# Altium project acopians-hw.PrjPcb (part 1 of 2)
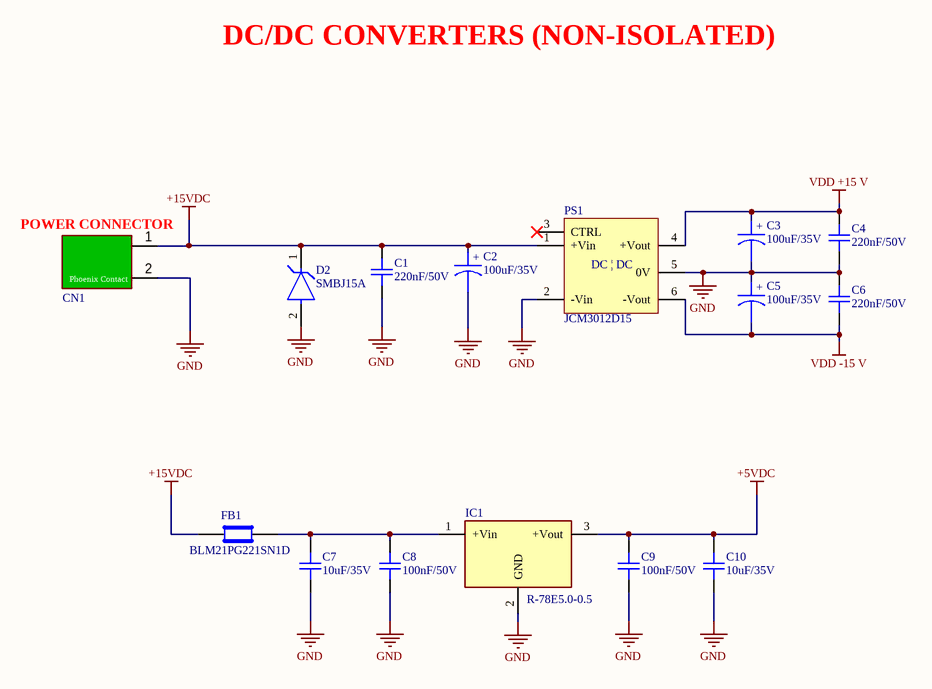
[diagram p0: power-supply-hw.SchDoc]
Project Link: =ProjectLink
5 sheets, 79 parts. Net scope: global (net labels, ports and power ports of the same name join across sheets).
Board file: pcb-power-supply-measurement-hw.PcbDoc
Sheets:
  power-supply-hw.SchDoc
  vmon-and-imon-measurements-hw.SchDoc
  outputs-voltage-and-current-measurements-hw.SchDoc
  voltage-and-current-display-hw.SchDoc
  monitoring-sources-with-mbed-hw.SchDoc

## Sheet power-supply-hw.SchDoc
size A4; DrawnBy: Rogério J. Marcondeli / Samuel C. Z. Fraga

### Parts
C1  220nF/50V  [C0805]
C2  100uF/35V  [CAP_ALUM_case_D8]
C3  100uF/35V  [CAP_ALUM_case_D8]
C4  220nF/50V  [C0805]
C5  100uF/35V  [CAP_ALUM_case_D8]
C6  220nF/50V  [C0805]
C7  10uF/35V  [C0805]
C8  100nF/50V  [C0805]
C9  100nF/50V  [C0805]
C10  10uF/35V  [C0805]
CN1  1755736  [Conector Phoenix 2 vias 1755736]  (value not drawn)
D2  SMBJ15A  [FP-SMBJ-MFG]
FB1  BLM21PG221SN1D  [Ferrite_Bead_0805]
IC1  R-78E5.0-0.5  [R-78E5.0-0.5]
PS1  JCM3012D15  [JCM30]

### Nets
+5VDC: C9.2 C10.2 IC1.3(+Vout)
+15VDC: C1.2 C2.1(Lid_+) CN1.1 D2.1(C) FB1.1 PS1.1(+Vin)
GND: C1.1 C2.2 C3.2 C4.1 C5.1(Lid_+) C6.1 C7.1 C8.1 C9.1 C10.1 CN1.2 D2.2(A) IC1.2(GND) PS1.2(-Vin) PS1.5(0V)
VDD +15 V: C3.1(Lid_+) C4.2 PS1.4(+Vout)
VDD -15 V: C5.2 C6.2 PS1.6(-Vout)
NetC7_2: C7.2 C8.2 FB1.2 IC1.1(+Vin)

Not connected (* = marked no-connect by the designer): PS1 3(CTRL)*

### Notes on the sheet
- DC/DC CONVERTERS (NON-ISOLATED)
- (near CN1) POWER CONNECTOR
- Authors:
- Title:
- Revision:
- File:
- Project:
- Date:
- Variant:
- Sheet
- of
- DAT - INE - EMI
  Eletrônica e
  Microeletrônica
- (in symbol CAPACITOR 100uF/35V) +
- (in symbol JCM3012D15) DC | DC

### Library data of the parts
C1 C4 C6 = CAPACITOR 220nF/50V: Capacitor 220NF 50V X7R 0805; Manufacturer: Murata; Manufacturer Part Number: GRM21BR71H224MA01L; Tolerance: 20%; Código LNLS: AP112018; Supplier 1: Digi-Key; RoHS: Yes; Category: Ceramic Capacitors; Stock 1: 27774; Pricing 1: 1=0,37000, 10=0,25200, 50=0,16800, 100=0,14270, 500=0,10074, 1000=0,08815 (USD); Mount: Surface Mount; Case/Package: 0805; Case Code (Metric): 2012; Case Code (Imperial): 0805; Min Operating Temperature: -55°C; Max Operating Temperature: 125°C; Package Quantity: 1; Capacitance: 220nF; Packaging: Tape and Reel; Voltage Rating: 50V; Dielectric: X7R; Termination: SMD/SMT; Voltage Rating (DC): 50V; Series: GRM; Construction: Flat; Length: 2mm; Width: 0.049inch; Height: 1.25mm; Thickness: 0.053inch; Depth: 1.25mm; Radiation Hardening: No; Lead Free: Lead Free; RoHS Compliant: Yes; ComponentLink1URL: https://datasheet.ciiva.com/5421/product-5421097.pdf?src-supplier=Mouser; ComponentLink1Description: https://datasheet.ciiva.com/5421/product-5421097.pdf?src-supplier=Mouser; ComponentLink2URL: https://datasheet.ciiva.com/136/partnumbering-e-01-136537.pdf?src-supplier=Digi-Key; ComponentLink2Description: https://datasheet.ciiva.com/136/partnumbering-e-01-136537.pdf?src-supplier=Digi-Key; ComponentLink3URL: https://datasheet.ciiva.com/136/partnumbering-e-01-136536.pdf?src-supplier=Digi-Key; ComponentLink3Description: https://datasheet.ciiva.com/136/partnumbering-e-01-136536.pdf?src-supplier=Digi-Key; ComponentLink4URL: https://datasheet.ciiva.com/136/partnumbering-e-01-136538.pdf?src-supplier=Digi-Key; ComponentLink4Description: https://datasheet.ciiva.com/136/partnumbering-e-01-136538.pdf?src-supplier=Digi-Key; Supplier Part Number 1: 490-1671-1-ND
C2 C3 C5 = CAPACITOR 100uF/35V: Capacitor Alum 100UF 35V 20% SMD - EEE-HAV101XAP; Manufacturer: Panasonic; Capacitance: 100µF; Lifetime @ Temp.: 1000 Hrs @ 105°C; Ripple Current: 84mA; Surface Mount Land Size: 0.260" L x 0.260" W (6.60mm x 6.60mm); Código LNLS: AP105066; Part Number: EEE-HAV101XAP; Supplier 1: Digi-Key; Supplier Part Number 1: PCE4726CT-ND; Value: 100uF; Manufacturer Part Number: EEE-HAV101XAP; RoHS: RoHS Compliant; Category: Capacitors; Stock 1: 1957; Pricing 1: 1=0.63, 50=0.3758, 100=0.3289, 250=0.2584, 500=0.2349 (USD); Packaging: Cut Tape (CT); Tolerance: ±20%; Voltage Rating: 35V; ESR (Equivalent Series Resistance): -; Operating Temperature: -40°C ~ 105°C; Type: -; Applications: Automotive; Impedance: -; Lead Spacing: -; Size / Dimension: 0.248" Dia (6.30mm); Height - Seated (Max): 0.303" (7.70mm); Mounting Type: Surface Mount; Package / Case: Radial, Can - SMD; ComponentLink1URL: http://industrial.panasonic.com/www-cgi/jvcr13pz.cgi?E+PZ+3+ABA0116+EEEHAV101XAP+7+WW; ComponentLink1Description: http://industrial.panasonic.com/www-cgi/jvcr13pz.cgi?E+PZ+3+ABA0116+EEEHAV101XAP+7+WW
C7 C10 = CAPACITOR 10uF/35V: Capacitor 10UF 35V X5R 0805; Manufacturer: TDK; Manufacturer Part Number: C2012X5R1V106K085AC; Dielectric Material: Ceramic; Tolerance: 10%; Código LNLS: AP105062; Supplier 1: Digi-Key; Stock 1: 56135; Pricing 1: 1=0.73, 10=0.519, 100=0.3416, 500=0.253, 1000=0.2151 (USD); Case/Package: 0805; Weight: 0.000194oz; Case Code (Metric): 2012; Case Code (Imperial): 0805; Min Operating Temperature: -55°C; Max Operating Temperature: 85°C; Package Quantity: 1; Packaging: Tape and Reel; Capacitance: 10uF; Voltage Rating: 35V; Dielectric: X5R; Termination: SMD/SMT; Voltage Rating (DC): 35V; Length: 0.079inch; Height: 0.85mm; Width: 0.049inch; Thickness: 0.039inch; REACH SVHC: No SVHC; Lead Free: Lead Free; ComponentLink1URL: https://datasheet.ciiva.com/14894/tdkmlcccaprange-14894527.pdf; ComponentLink1Description: https://datasheet.ciiva.com/14894/tdkmlcccaprange-14894527.pdf; Supplier Part Number 1: 445-14417-1-ND
C8 C9 = CAPACITOR 100nF/50V: Capacitor 0.1UF 50V X7R 0805; Manufacturer 1: Kyocera AVX; Manufacturer Part Number 1: 08055C104KAZ2A; Description 1: Capacitor Ceramic 0.1uF 50V X7R 10% SMD 0805 FlexiTerm 125C Paper T/R; Category 1: Ceramic Capacitors; Capacitance: 100nF; Tolerance: 10%; Temperature Coefficient: 30ppm/°C; Dissipation Factor: 2.5%; Código LNLS: AP106675; Supplier 1: Arrow Electronics; Supplier Part Number 1: 08055C104KAZ2A; RoHS 1: Yes; Stock 1: 28000; Pricing 1: 4000=0,0262 (USD); Mount: Surface Mount,PCB; Case/Package: 0805; Number of Pins: 2; Case Code (Metric): 2012; Case Code (Imperial): 0805; Min Operating Temperature: -55°C; Max Operating Temperature: 125°C; Packaging: Tape and Reel; Voltage Rating (DC): 50V; Dielectric: X7R; Package Quantity: 4000; Series: FLEXITERM®; Voltage Rating: 50V; Termination: SMD/SMT; Voltage: 50V; Features: Soft Termination; Construction: Flat; Length: 2.01mm; Width: 1.25mm; Height: 0.94mm; Depth: 1.25mm; Reach SVHC Compliant: No; Lead Free: Lead Free; RoHS Compliant: Yes; ComponentLink1URL: https://datasheet.ciiva.com/28613/630895-28613376.pdf?src-supplier=Element14; ComponentLink1Description: https://datasheet.ciiva.com/28613/630895-28613376.pdf?src-supplier=Element14; ComponentLink2URL: https://datasheet.ciiva.com/11788/0900766b80dc2409-11788550.pdf?src-supplier=Rs; ComponentLink2Description: https://datasheet.ciiva.com/11788/0900766b80dc2409-11788550.pdf?src-supplier=Rs; ComponentLink3URL: https://datasheet.ciiva.com/30514/2014094-30514066.pdf?src-supplier=Jameco; ComponentLink3Description: https://datasheet.ciiva.com/30514/2014094-30514066.pdf?src-supplier=Jameco; ComponentLink4URL: https://datasheet.ciiva.com/11499/flexiterm-11499901.pdf?src-supplier=Avnet; ComponentLink4Description: https://datasheet.ciiva.com/11499/flexiterm-11499901.pdf?src-supplier=Avnet; ComponentLink5URL: https://datasheet.ciiva.com/5417/cx7r-218113-5417323.pdf?src-supplier=Mouser; ComponentLink5Description: https://datasheet.ciiva.com/5417/cx7r-218113-5417323.pdf?src-supplier=Mouser; ComponentLink6URL: https://datasheet.ciiva.com/28613/630895-28613368.pdf?src-supplier=Element14; ComponentLink6Description: https://datasheet.ciiva.com/28613/630895-28613368.pdf?src-supplier=Element14; ComponentLink7URL: https://datasheet.ciiva.com/151/flexiterm-151512.pdf?src-supplier=Digi-Key; ComponentLink7Description: https://datasheet.ciiva.com/151/flexiterm-151512.pdf?src-supplier=Digi-Key; ComponentLink8URL: https://datasheet.ciiva.com/151/flexiterm-151513.pdf?src-supplier=Digi-Key; ComponentLink8Description: https://datasheet.ciiva.com/151/flexiterm-151513.pdf?src-supplier=Digi-Key; ComponentLink9URL: https://datasheet.ciiva.com/151/flexiterm-151514.pdf?src-supplier=Digi-Key; ComponentLink9Description: https://datasheet.ciiva.com/151/flexiterm-151514.pdf?src-supplier=Digi-Key; ComponentLink10URL: https://datasheet.ciiva.com/14602/70001075-14602617.pdf?src-supplier=Allied+Electronics; ComponentLink10Description: https://datasheet.ciiva.com/14602/70001075-14602617.pdf?src-supplier=Allied+Electronics; ComponentLink11URL: https://datasheet.ciiva.com/16427/cx7r-16427406.pdf?src-supplier=Future+Electronics; ComponentLink11Description: https://datasheet.ciiva.com/16427/cx7r-16427406.pdf?src-supplier=Future+Electronics
CN1 = CONECTOR PHOENIX 2 VIAS 1755736: Manufacturer: Phoenix Contact; Number of Positions: 2; Number of Levels: 1; Pitch: 0.200" (5.08mm); Header Orientation: Vertical; Current - IEC: 12A; Voltage - IEC: 630V; Voltage - UL: 300V; Material Flammability Rating: UL94 V-0; Contact Tail Length: 0.154" (3.90mm); Código LNLS: MT101663; Supplier 1: Digi-Key; Manufacturer Part Number: 1755736; RoHS: RoHS Compliant; Category: Connectors, Interconnects; Stock 1: 11008; Pricing 1: 1=0.59, 10=0.564, 50=0.539, 100=0.5243, 250=0.49, 500=0.4508, 1000=0.4165, 2500=0.3969, 5000=0.3724 (USD); Packaging: Bulk; Part Status: Active; Type: Header, Male Pins, Shrouded (4 Side); Positions Per Level: 2; Plug Wire Entry: -; Termination Style: Solder; Mounting Type: Through Hole; Current - UL: 12A; Wire Gauge or Range - AWG: -; Wire Gauge or Range - mm²: -; Color: Green; Operating Temperature: -; Contact Mating Finish: Tin; Features: -; Ingress Protection: -; Screw Size: -; Torque - Screw: -; Wire Strip Length: -; Contact Material: -; Housing Material: Polyamide (PA), Nylon; Insulation Height: 0.472" (12.00mm); ComponentLink1URL: http://media.digikey.com/pdf/Data%20Sheets/Phoenix%20Contact%20PDFs/1755736.pdf; ComponentLink1Description: http://media.digikey.com/pdf/Data%20Sheets/Phoenix%20Contact%20PDFs/1755736.pdf; Supplier Part Number 1: 277-1150-ND
D2 = CMP-07401-000033-1: TVS DIODE 15VWM 24.4VC SMB; Max Breakdown Voltage: 19.2V; Reverse Standoff Voltage: 15V; Number of Elements: 1; Diode Type: ZENER; Max Reverse Leakage Current: 5uA; Operating Supply Voltage: 3.5V; Element Configuration: Single; Reverse Breakdown Voltage: 16.7V; Peak Pulse Power: 600W; Peak Pulse Current: 24A; Polarity: Unidirectional; Clamping Voltage: 24.4V; ESD Protection: Yes; Test Current: 1mA; Power Line Protection: No; Max Surge Current: 100A; Min Operating Temperature: -55°C; Number of Pins: 2; Case/Package: DO-214AA; Number of Channels: 1; Series: SMBJ; Height: 2.42mm; Resistor Type: Zener; Max Power Dissipation: 600W; REACH SVHC: No SVHC; Package Quantity: 1; Breakdown Voltage: 19.2V; Radiation Hardening: No; Direction: Unidirectional; Number of Unidirectional Channels: 1; Termination: SMD/SMT; Length: 4.57mm; Width: 3.94mm; Packaging: Tape and Reel; Leakage Current: 5uA; RoHS Compliant: Yes; Mount: Surface Mount; Min Breakdown Voltage: 16.7V; Max Operating Temperature: 150°C
FB1 = BLM21PG221SN1D: Ferrite Bead 220 OHM 0805 1LN; Manufacturer 1: Murata; Description 1: Ferrite Beads Multi-Layer 220Ohm 25% 100MHz 2A 45mOhm DCR 0805 Paper T/R; Category 1: Ferrite Beads and Chips; Material: Steel,Ferrite; Impedance: 220R; Tolerance: 25%; Max Current Rating: 2A; Number of Lines: 1; DC Resistance (DCR): 45mR; Test Frequency: 100MHz; Shielding: Unshielded; Código LNLS: AP105046; Supplier 1: Digi-Key; Supplier Part Number 1: 490-1054-2-ND; Manufacturer Part Number 1: BLM21PG221SN1D; RoHS 1: Yes; Stock 1: 2578074; Pricing 1: 4000=0,03608, 8000=0,02744, 28000=0,02352 (USD); Case/Package: 0805; Number of Pins: 2; Core Material: Ferrite; Case Code (Metric): 2012; Case Code (Imperial): 0805; Min Operating Temperature: -55°C; Max Operating Temperature: 125°C; Package Quantity: 1; Packaging: Tape and Reel; Current Rating: 2A; Max DC Current: 2A; Termination: SMD/SMT; DC Current: 2A; Frequency: 100MHz; Number of Circuits: 1; Current: 2A; Series: BLM21P; DC Resistance-Max: 45mR; RMS Current (Irms): 2A; Series Resistance: 45mR; Length: 2mm; Width: 1.25mm; Height: 0.85mm; Depth: 1.25mm; Radiation Hardening: No; RoHS Compliant: Yes; Reach SVHC Compliant: No; Military Standard: Not; Lead Free: Lead Free; ComponentLink1URL: https://datasheet.ciiva.com/30514/1845321-30514028.pdf?src-supplier=Jameco; ComponentLink1Description: https://datasheet.ciiva.com/30514/1845321-30514028.pdf?src-supplier=Jameco; ComponentLink2URL: https://datasheet.ciiva.com/1012/l0110s0100blm21p-1012288.pdf?src-supplier=Digi-Key; ComponentLink2Description: https://datasheet.ciiva.com/1012/l0110s0100blm21p-1012288.pdf?src-supplier=Digi-Key; ComponentLink3URL: https://datasheet.ciiva.com/11799/0900766b81275e31-11799232.pdf?src-supplier=Rs; ComponentLink3Description: https://datasheet.ciiva.com/11799/0900766b81275e31-11799232.pdf?src-supplier=Rs; ComponentLink4URL: https://datasheet.ciiva.com/29348/442529-da-01-en-chip-drossel-0805-220r-2000ma-2-0x1-25mm-29348007.pdf?src-supplier=Conrad; ComponentLink4Description: https://datasheet.ciiva.com/29348/442529-da-01-en-chip-drossel-0805-220r-2000ma-2-0x1-25mm-29348007.pdf?src-supplier=Conrad; ComponentLink5URL: https://datasheet.ciiva.com/8021/1756152-8021596.pdf?src-supplier=Element14; ComponentLink5Description: https://datasheet.ciiva.com/8021/1756152-8021596.pdf?src-supplier=Element14; ComponentLink6URL: https://datasheet.ciiva.com/14122/anblm21p-data-e-14122214.pdf?src-supplier=Distrelec; ComponentLink6Description: https://datasheet.ciiva.com/14122/anblm21p-data-e-14122214.pdf?src-supplier=Distrelec; ComponentLink7URL: https://datasheet.ciiva.com/1012/l0110s0100blm21p-1012287.pdf?src-supplier=Digi-Key; ComponentLink7Description: https://datasheet.ciiva.com/1012/l0110s0100blm21p-1012287.pdf?src-supplier=Digi-Key; ComponentLink8URL: https://datasheet.ciiva.com/1012/l0110s0100blm21p-1012289.pdf?src-supplier=Digi-Key; ComponentLink8Description: https://datasheet.ciiva.com/1012/l0110s0100blm21p-1012289.pdf?src-supplier=Digi-Key; ComponentLink9URL: https://datasheet.ciiva.com/8021/1756152-8021598.pdf?src-supplier=Element14; ComponentLink9Description: https://datasheet.ciiva.com/8021/1756152-8021598.pdf?src-supplier=Element14; ComponentLink10URL: https://datasheet.ciiva.com/3081/l0110s0100blm21p-3081655.pdf?src-supplier=Avnet; ComponentLink10Description: https://datasheet.ciiva.com/3081/l0110s0100blm21p-3081655.pdf?src-supplier=Avnet; ComponentLink11URL: https://datasheet.ciiva.com/16215/l0110s0100blm21p-16215194.pdf?src-supplier=Future+Electronics; ComponentLink11Description: https://datasheet.ciiva.com/16215/l0110s0100blm21p-16215194.pdf?src-supplier=Future+Electronics
IC1 = R-78E5.0-0.5: CONV DC/DC 5V 500MA OUT THRU; Manufacturer: Recom; Power Rating: 2.5W; Min Input Voltage (DC): 7V; Max Input Voltage (DC): 28V; Number of Outputs: 1; Efficiency: 92%; Isolation: Non-Isolated; Max Power Dissipation: 3W; Código LNLS: AP105018; Supplier 1: Digi-Key; Manufacturer Part Number: R-78E5.0-0.5; Stock 1: 10893; Pricing 1: 1=2.7, 5=2.656, 10=2.618, 25=2.5412, 50=2.464, 100=2.387, 250=2.31, 500=2.156 (USD); Mount: Through Hole,PCB; Case/Package: SIP; Number of Pins: 3; Weight: 2g; Min Operating Temperature: -40°C; Max Operating Temperature: 85°C; Nominal Output Voltage: 5V; Max Output Current: 500mA; Output Current: 500mA; Output Voltage: 5V; Output Power: 2.5W; Packaging: Rail/Tube; Min Input Voltage: 7V; Package Quantity: 42; Voltage - Output 1: 5V; Current - Output 1: 500mA; Max Input Voltage: 28V; Max Output Power: 2.5W; Max Output Voltage: 5V; Length: 11.6mm; Height: 10.4mm; Width: 8.5mm; Depth: 11.6mm; REACH SVHC: No SVHC; Lead Free: Lead Free; ComponentLink1URL: https://datasheet.ciiva.com/7618/1518729-7618512.pdf; ComponentLink1Description: https://datasheet.ciiva.com/7618/1518729-7618512.pdf; ComponentLink2URL: https://datasheet.ciiva.com/16366/r-78exx-0-5-16366357.pdf; ComponentLink2Description: https://datasheet.ciiva.com/16366/r-78exx-0-5-16366357.pdf; ComponentLink3URL: https://datasheet.ciiva.com/14155/r78xx-05-eng-datasheet-14155703.pdf; ComponentLink3Description: https://datasheet.ciiva.com/14155/r78xx-05-eng-datasheet-14155703.pdf; ComponentLink4URL: https://datasheet.ciiva.com/25627/0900766b810a2db7-25627246.pdf; ComponentLink4Description: https://datasheet.ciiva.com/25627/0900766b810a2db7-25627246.pdf; ComponentLink5URL: https://datasheet.ciiva.com/2168/r-78exx-0-5-02-2168671.pdf; ComponentLink5Description: https://datasheet.ciiva.com/2168/r-78exx-0-5-02-2168671.pdf; Supplier Part Number 1: 945-1648-5-ND
PS1 = JCM3012D15: DC-DC, 30W, DUAL OUTPUT, 2:1, 1X; Manufacturer: XP Power; Number of Outputs: 2; Voltage - Input (Min): 9V; Voltage - Input (Max): 18V; Voltage - Output 1: 15V; Voltage - Output 2: -15V; Current - Output (Max): 1A, 1A; Voltage - Isolation: 1.6kV (1600V); Efficiency: 90%; Código LNLS: MT103202; Supplier 1: Digi-Key; Manufacturer Part Number: JCM3012D15; RoHS: RoHS Compliant; Category: Power Supplies - Board Mount; Stock 1: 20; Pricing 1: 1=41, 5=39.77, 10=38.54, 25=36.9004, 100=34.697 (USD); Packaging: Tube; Part Status: Active; Type: Isolated Module; Voltage - Output 3: -; Power (Watts) - Manufacture Series: 30W; Applications: ITE (Commercial); Features: Remote On/Off, OVP, SCP; Mounting Type: Through Hole; Package / Case: 6-DIP Module; Size / Dimension: 1.00" L x 1.00" W x 0.41" H (25.4mm x 25.4mm x 10.4mm); Operating Temperature: -40°C ~ 100°C; ComponentLink1URL: http://www.xppower.com/Portals/0/pdfs/SF_JCM30.pdf; ComponentLink1Description: http://www.xppower.com/Portals/0/pdfs/SF_JCM30.pdf; Supplier Part Number 1: 1470-3706-ND

## Sheet vmon-and-imon-measurements-hw.SchDoc
size A4; DrawnBy: Rogério J. Marcondeli / Samuel C. Z. Fraga
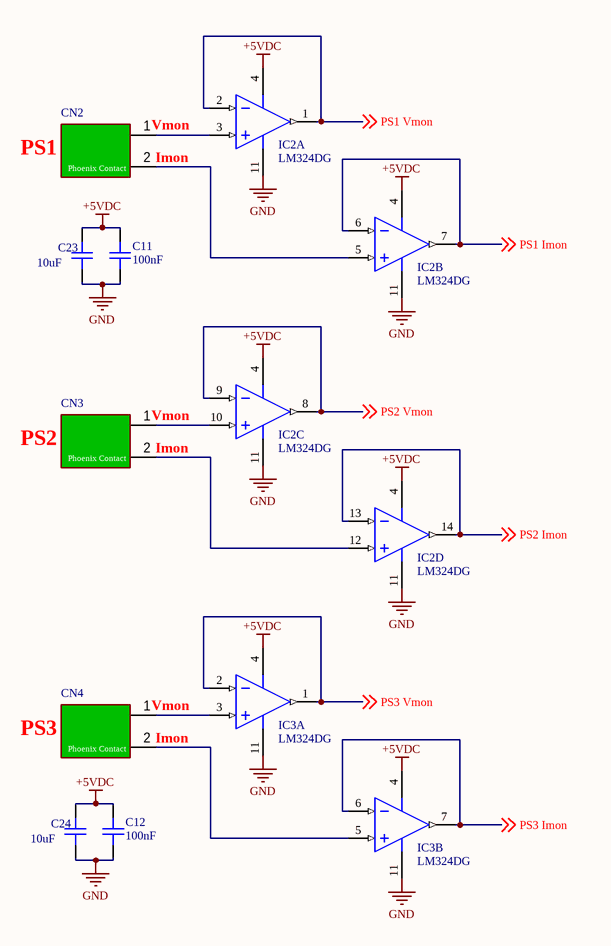
[diagram p1: vmon-and-imon-measurements-hw.SchDoc]

### Parts
C11  100nF  [C0805]
C12  100nF  [C0805]
C23  10uF  [C0805]
C24  10uF  [C0805]
CN2  1755736  [Conector Phoenix 2 vias 1755736]  (value not drawn)
CN3  1755736  [Conector Phoenix 2 vias 1755736]  (value not drawn)
CN4  1755736  [Conector Phoenix 2 vias 1755736]  (value not drawn)
IC2  LM324DG  [SOIC-14]  (parts A,B,C,D of 4)
IC3  LM324DG  [SOIC-14]  (parts A,B of 4)

### Nets
+5VDC: C11.2 C12.2 C23.1 C24.1 IC2.4(V+) IC3.4(V+)
GND: C11.1 C12.1 C23.2 C24.2 IC2.11(V-) IC3.11(V-)
PS1 Imon: IC2.6(IN_B-) IC2.7(OUT_B) ; off-sheet PS1 Imon
PS1 Vmon: IC2.1(OUT_A) IC2.2(IN_A-) ; off-sheet PS1 Vmon
PS2 Imon: IC2.13(IN_D-) IC2.14(OUT_D) ; off-sheet PS2 Imon
PS2 Vmon: IC2.8(OUT_C) IC2.9(IN_C-) ; off-sheet PS2 Vmon
PS3 Imon: IC3.6(IN_B-) IC3.7(OUT_B) ; off-sheet PS3 Imon
PS3 Vmon: IC3.1(OUT_A) IC3.2(IN_A-) ; off-sheet PS3 Vmon
NetCN2_1: CN2.1 IC2.3(IN_A+)
NetCN2_2: CN2.2 IC2.5(IN_B+)
NetCN3_1: CN3.1 IC2.10(IN_C+)
NetCN3_2: CN3.2 IC2.12(IN_D+)
NetCN4_1: CN4.1 IC3.3(IN_A+)
NetCN4_2: CN4.2 IC3.5(IN_B+)

### Notes on the sheet
- PS1
- (near CN2) Vmon
- (near CN2) Imon
- (near CN3) Vmon
- PS2
- (near CN3) Imon
- (near CN4) Vmon
- PS3
- (near CN4) Imon
- Authors:
- Title:
- Revision:
- File:
- Project:
- Date:
- Variant:
- Sheet
- of
- DAT - INE - EMI
  Eletrônica e
  Microeletrônica

### Library data of the parts
C11 C12 = CAPACITOR 100nF/50V: Capacitor 0.1UF 50V X7R 0805; Manufacturer 1: Kyocera AVX; Manufacturer Part Number 1: 08055C104KAZ2A; Description 1: Capacitor Ceramic 0.1uF 50V X7R 10% SMD 0805 FlexiTerm 125C Paper T/R; Category 1: Ceramic Capacitors; Tolerance: 10%; Temperature Coefficient: 30ppm/°C; Dissipation Factor: 2.5%; Código LNLS: AP106675; Supplier 1: Arrow Electronics; Supplier Part Number 1: 08055C104KAZ2A; RoHS 1: Yes; Stock 1: 28000; Pricing 1: 4000=0,0262 (USD); Mount: Surface Mount,PCB; Case/Package: 0805; Number of Pins: 2; Case Code (Metric): 2012; Case Code (Imperial): 0805; Min Operating Temperature: -55°C; Max Operating Temperature: 125°C; Packaging: Tape and Reel; Capacitance: 100nF; Voltage Rating (DC): 50V; Dielectric: X7R; Package Quantity: 4000; Series: FLEXITERM®; Voltage Rating: 50V; Termination: SMD/SMT; Voltage: 50V; Features: Soft Termination; Construction: Flat; Length: 2.01mm; Width: 1.25mm; Height: 0.94mm; Depth: 1.25mm; Reach SVHC Compliant: No; Lead Free: Lead Free; RoHS Compliant: Yes; ComponentLink1URL: https://datasheet.ciiva.com/28613/630895-28613376.pdf?src-supplier=Element14; ComponentLink1Description: https://datasheet.ciiva.com/28613/630895-28613376.pdf?src-supplier=Element14; ComponentLink2URL: https://datasheet.ciiva.com/11788/0900766b80dc2409-11788550.pdf?src-supplier=Rs; ComponentLink2Description: https://datasheet.ciiva.com/11788/0900766b80dc2409-11788550.pdf?src-supplier=Rs; ComponentLink3URL: https://datasheet.ciiva.com/30514/2014094-30514066.pdf?src-supplier=Jameco; ComponentLink3Description: https://datasheet.ciiva.com/30514/2014094-30514066.pdf?src-supplier=Jameco; ComponentLink4URL: https://datasheet.ciiva.com/11499/flexiterm-11499901.pdf?src-supplier=Avnet; ComponentLink4Description: https://datasheet.ciiva.com/11499/flexiterm-11499901.pdf?src-supplier=Avnet; ComponentLink5URL: https://datasheet.ciiva.com/5417/cx7r-218113-5417323.pdf?src-supplier=Mouser; ComponentLink5Description: https://datasheet.ciiva.com/5417/cx7r-218113-5417323.pdf?src-supplier=Mouser; ComponentLink6URL: https://datasheet.ciiva.com/28613/630895-28613368.pdf?src-supplier=Element14; ComponentLink6Description: https://datasheet.ciiva.com/28613/630895-28613368.pdf?src-supplier=Element14; ComponentLink7URL: https://datasheet.ciiva.com/151/flexiterm-151512.pdf?src-supplier=Digi-Key; ComponentLink7Description: https://datasheet.ciiva.com/151/flexiterm-151512.pdf?src-supplier=Digi-Key; ComponentLink8URL: https://datasheet.ciiva.com/151/flexiterm-151513.pdf?src-supplier=Digi-Key; ComponentLink8Description: https://datasheet.ciiva.com/151/flexiterm-151513.pdf?src-supplier=Digi-Key; ComponentLink9URL: https://datasheet.ciiva.com/151/flexiterm-151514.pdf?src-supplier=Digi-Key; ComponentLink9Description: https://datasheet.ciiva.com/151/flexiterm-151514.pdf?src-supplier=Digi-Key; ComponentLink10URL: https://datasheet.ciiva.com/14602/70001075-14602617.pdf?src-supplier=Allied+Electronics; ComponentLink10Description: https://datasheet.ciiva.com/14602/70001075-14602617.pdf?src-supplier=Allied+Electronics; ComponentLink11URL: https://datasheet.ciiva.com/16427/cx7r-16427406.pdf?src-supplier=Future+Electronics; ComponentLink11Description: https://datasheet.ciiva.com/16427/cx7r-16427406.pdf?src-supplier=Future+Electronics
C23 C24 = CAPACITOR 10uF/35V: as C7 on sheet power-supply-hw; Supplier 1: Digi-Key; Stock 1: 56135; Pricing 1: 1=0.73, 10=0.519, 100=0.3416, 500=0.253, 1000=0.2151 (USD); Case/Package: 0805; Weight: 0.000194oz; Case Code (Metric): 2012; Case Code (Imperial): 0805; Min Operating Temperature: -55°C; Max Operating Temperature: 85°C; Package Quantity: 1; Packaging: Tape and Reel; Capacitance: 10uF; Voltage Rating: 35V; Dielectric: X5R; Termination: SMD/SMT; Voltage Rating (DC): 35V; Length: 0.079inch; Height: 0.85mm; Width: 0.049inch; Thickness: 0.039inch; REACH SVHC: No SVHC; Lead Free: Lead Free; ComponentLink1URL: https://datasheet.ciiva.com/14894/tdkmlcccaprange-14894527.pdf; ComponentLink1Description: https://datasheet.ciiva.com/14894/tdkmlcccaprange-14894527.pdf; Supplier Part Number 1: 445-14417-1-ND
CN2-CN4 = CONECTOR PHOENIX 2 VIAS 1755736: as CN1 on sheet power-supply-hw; Supplier 1: Digi-Key; Manufacturer Part Number: 1755736; RoHS: RoHS Compliant; Category: Connectors, Interconnects; Stock 1: 11008; Pricing 1: 1=0.59, 10=0.564, 50=0.539, 100=0.5243, 250=0.49, 500=0.4508, 1000=0.4165, 2500=0.3969, 5000=0.3724 (USD); Packaging: Bulk; Part Status: Active; Type: Header, Male Pins, Shrouded (4 Side); Positions Per Level: 2; Plug Wire Entry: -; Termination Style: Solder; Mounting Type: Through Hole; Current - UL: 12A; Wire Gauge or Range - AWG: -; Wire Gauge or Range - mm²: -; Color: Green; Operating Temperature: -; Contact Mating Finish: Tin; Features: -; Ingress Protection: -; Screw Size: -; Torque - Screw: -; Wire Strip Length: -; Contact Material: -; Housing Material: Polyamide (PA), Nylon; Insulation Height: 0.472" (12.00mm); ComponentLink1URL: http://media.digikey.com/pdf/Data%20Sheets/Phoenix%20Contact%20PDFs/1755736.pdf; ComponentLink1Description: http://media.digikey.com/pdf/Data%20Sheets/Phoenix%20Contact%20PDFs/1755736.pdf; Supplier Part Number 1: 277-1150-ND
IC2 IC3 = LM324DG: Operational Amplifiers - Op Amps 3-32V Quad 5mV; Manufacturer 1: Texas Instruments; Manufacturer Part Number 1: LM324DG4; Description 1: 4-Channel industry standard operational amplifier 14-SOIC 0 to 70; Category 1: Amplifiers - Op Amps, Buffer, Instrumentation; Operating Supply Voltage: 16V; Voltage Gain: 100dB; Slew Rate: 0.5V/µs; Common Mode Rejection Ratio: 65dB; Number of Channels: 4; Output Current: 30mA; Max Supply Voltage: 32V; Min Supply Voltage: 3V; Min Dual Supply Voltage: 1.5V; Gain Bandwidth Product: 1.2MHz; Input Bias Current: 20nA; Input Offset Voltage (Vos): 3mV; Operating Supply Current: 1.4mA; Output Current per Channel: 60mA; Amplifier Type: GENERAL PURPOSE; Supply Current: 3mA; Código LNLS: MT104472; Supplier 1: Mouser; Supplier Part Number 1: 595-LM324DG4; RoHS 1: Yes; Stock 1: 4026; Pricing 1: 1=0,9, 10=0,761, 50=0,761, 100=0,583, 1000=0,407, 10000=0,381 (USD); Mount: Surface Mount; Case/Package: SOIC; Number of Pins: 14; Min Operating Temperature: 0°C; Max Operating Temperature: 70°C; Package Quantity: 50; Packaging: Rail/Tube; Max Dual Supply Voltage: 16V; Number of Circuits: 4; Bandwidth: 1.2MHz; Technology: BIPOLAR; Radiation Hardening: No; Lead Free: Lead Free; RoHS Compliant: Yes; ComponentLink1URL: https://datasheet.ciiva.com/1811/lm224-1811004.pdf?src-supplier=Digi-Key; ComponentLink1Description: https://datasheet.ciiva.com/1811/lm224-1811004.pdf?src-supplier=Digi-Key

## Sheet outputs-voltage-and-current-measurements-hw.SchDoc
size A4; DrawnBy: Rogério J. Marcondeli / Samuel C. Z. Fraga
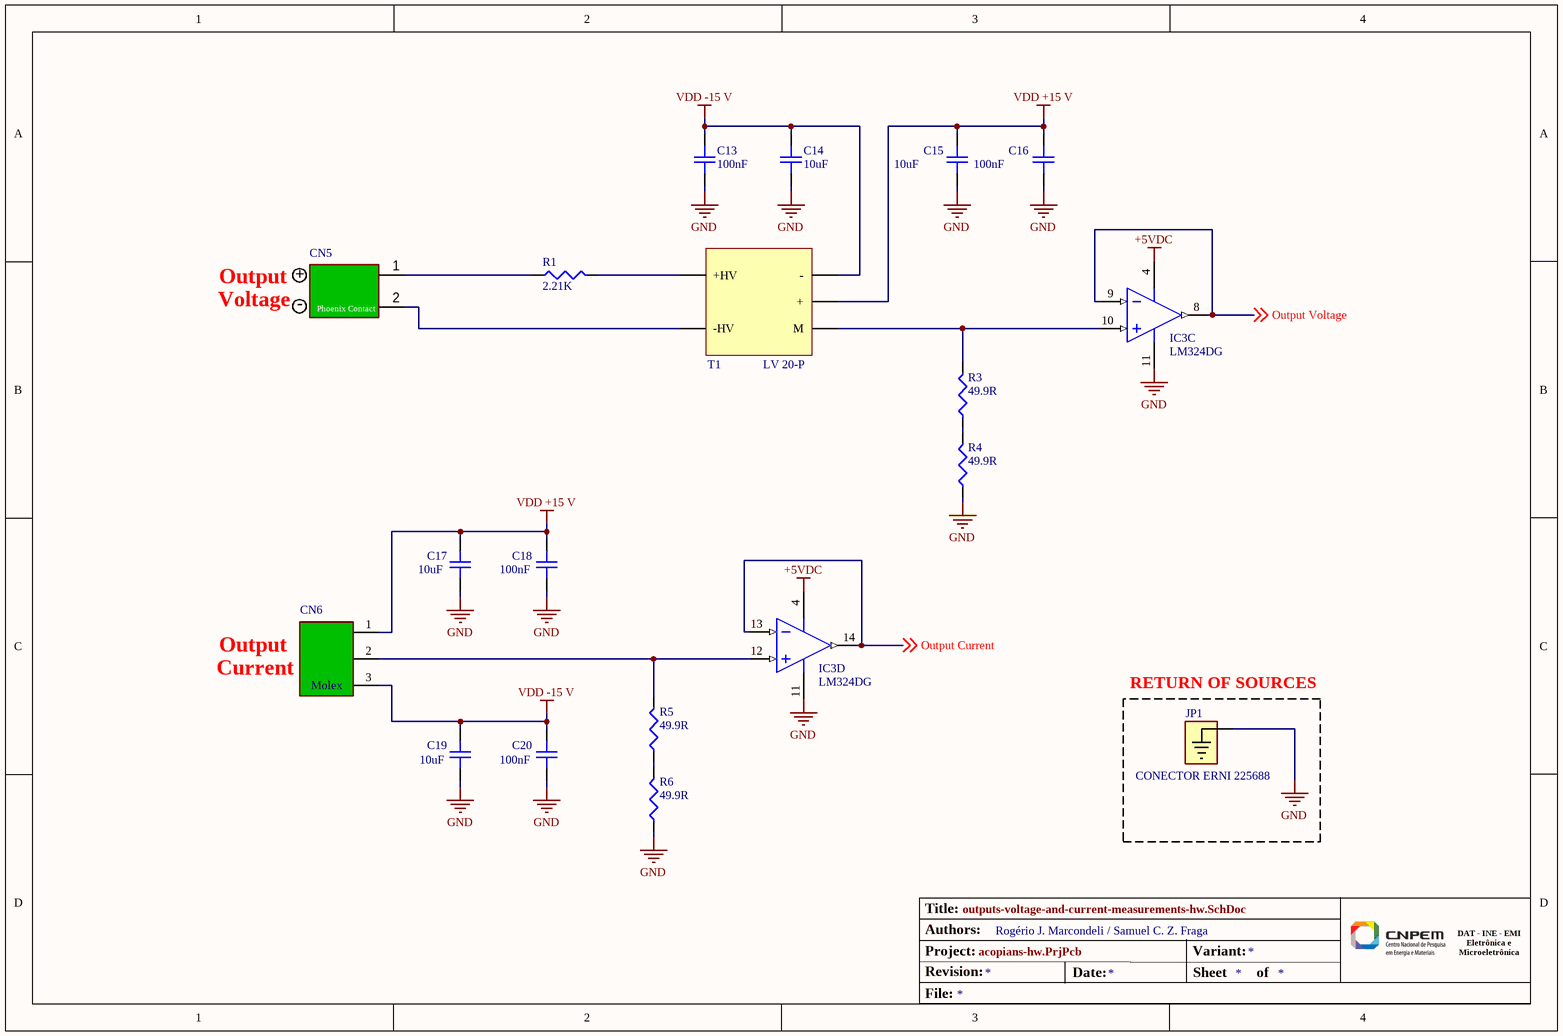
[diagram p2: outputs-voltage-and-current-measurements-hw.SchDoc]

### Parts
C13  100nF  [C0805]
C14  10uF  [C0805]
C15  10uF  [C0805]
C16  100nF  [C0805]
C17  10uF  [C0805]
C18  100nF  [C0805]
C19  10uF  [C0805]
C20  100nF  [C0805]
CN5  1755736  [Conector Phoenix 2 vias 1755736]  (value not drawn)
CN6  Header Molex 3 Pin 22-27-2031  [HEADER MOLEX 22 27 2031]  (value not drawn)
IC3  LM324DG  [SOIC-14]  (parts C,D of 4)
JP1  CONECTOR ERNI 225688  [CONECTOR ERNI 225688]
R1  2.21K  [R0805]
R3  49.9R  [R0603]
R4  49.9R  [R0603]
R5  49.9R  [R0603]
R6  49.9R  [R0603]
T1  Text: LV 20-P  [VOLTAGE TRANSDUCER LV 20-P]  (hidden comment: Voltagem Transducer LV 20-P)

### Blocks framed on the sheet
RETURN OF SOURCES: JP1

### Nets
+5VDC: IC3.4(V+)
GND: C13.1 C14.1 C15.1 C16.1 C17.1 C18.1 C19.1 C20.1 IC3.11(V-) JP1.1 R4.1 R6.1
VDD +15 V: C15.2 C16.2 C17.2 C18.2 CN6.1(+15V) T1.4(+)
VDD -15 V: C13.2 C14.2 C19.2 C20.2 CN6.3(-15V) T1.3(-)
Output Current: IC3.13(IN_D-) IC3.14(OUT_D) ; off-sheet Output Current
Output Voltage: IC3.8(OUT_C) IC3.9(IN_C-) ; off-sheet Output Voltage
NetCN5_1: CN5.1 R1.1
NetCN5_2: CN5.2 T1.2(-HV)
NetCN6_2: CN6.2(M) IC3.12(IN_D+) R5.2
NetIC3_10: IC3.10(IN_C+) R3.2 T1.5(M)
NetR1_2: R1.2 T1.1(+HV)
NetR3_1: R3.1 R4.2
NetR5_1: R5.1 R6.2

### Notes on the sheet
- Voltage
- Output
- +
- -
- Current
- Authors:
- Title:
- Revision:
- File:
- Project:
- Date:
- Variant:
- Sheet
- of
- DAT - INE - EMI
  Eletrônica e
  Microeletrônica
- (in symbol HEADER MOLEX 22-27-2031) Molex

### Library data of the parts
C13 C16 C18 C20 = CAPACITOR 100nF/50V: as C11 on sheet vmon-and-imon-measurements-hw; Supplier 1: Arrow Electronics; Supplier Part Number 1: 08055C104KAZ2A; RoHS 1: Yes; Stock 1: 28000; Pricing 1: 4000=0,0262 (USD); Mount: Surface Mount,PCB; Case/Package: 0805; Number of Pins: 2; Case Code (Metric): 2012; Case Code (Imperial): 0805; Min Operating Temperature: -55°C; Max Operating Temperature: 125°C; Packaging: Tape and Reel; Capacitance: 100nF; Voltage Rating (DC): 50V; Dielectric: X7R; Package Quantity: 4000; Series: FLEXITERM®; Voltage Rating: 50V; Termination: SMD/SMT; Voltage: 50V; Features: Soft Termination; Construction: Flat; Length: 2.01mm; Width: 1.25mm; Height: 0.94mm; Depth: 1.25mm; Reach SVHC Compliant: No; Lead Free: Lead Free; RoHS Compliant: Yes; ComponentLink1URL: https://datasheet.ciiva.com/28613/630895-28613376.pdf?src-supplier=Element14; ComponentLink1Description: https://datasheet.ciiva.com/28613/630895-28613376.pdf?src-supplier=Element14; ComponentLink2URL: https://datasheet.ciiva.com/11788/0900766b80dc2409-11788550.pdf?src-supplier=Rs; ComponentLink2Description: https://datasheet.ciiva.com/11788/0900766b80dc2409-11788550.pdf?src-supplier=Rs; ComponentLink3URL: https://datasheet.ciiva.com/30514/2014094-30514066.pdf?src-supplier=Jameco; ComponentLink3Description: https://datasheet.ciiva.com/30514/2014094-30514066.pdf?src-supplier=Jameco; ComponentLink4URL: https://datasheet.ciiva.com/11499/flexiterm-11499901.pdf?src-supplier=Avnet; ComponentLink4Description: https://datasheet.ciiva.com/11499/flexiterm-11499901.pdf?src-supplier=Avnet; ComponentLink5URL: https://datasheet.ciiva.com/5417/cx7r-218113-5417323.pdf?src-supplier=Mouser; ComponentLink5Description: https://datasheet.ciiva.com/5417/cx7r-218113-5417323.pdf?src-supplier=Mouser; ComponentLink6URL: https://datasheet.ciiva.com/28613/630895-28613368.pdf?src-supplier=Element14; ComponentLink6Description: https://datasheet.ciiva.com/28613/630895-28613368.pdf?src-supplier=Element14; ComponentLink7URL: https://datasheet.ciiva.com/151/flexiterm-151512.pdf?src-supplier=Digi-Key; ComponentLink7Description: https://datasheet.ciiva.com/151/flexiterm-151512.pdf?src-supplier=Digi-Key; ComponentLink8URL: https://datasheet.ciiva.com/151/flexiterm-151513.pdf?src-supplier=Digi-Key; ComponentLink8Description: https://datasheet.ciiva.com/151/flexiterm-151513.pdf?src-supplier=Digi-Key; ComponentLink9URL: https://datasheet.ciiva.com/151/flexiterm-151514.pdf?src-supplier=Digi-Key; ComponentLink9Description: https://datasheet.ciiva.com/151/flexiterm-151514.pdf?src-supplier=Digi-Key; ComponentLink10URL: https://datasheet.ciiva.com/14602/70001075-14602617.pdf?src-supplier=Allied+Electronics; ComponentLink10Description: https://datasheet.ciiva.com/14602/70001075-14602617.pdf?src-supplier=Allied+Electronics; ComponentLink11URL: https://datasheet.ciiva.com/16427/cx7r-16427406.pdf?src-supplier=Future+Electronics; ComponentLink11Description: https://datasheet.ciiva.com/16427/cx7r-16427406.pdf?src-supplier=Future+Electronics
C14 C15 C17 C19 = CAPACITOR 10uF/35V: as C7 on sheet power-supply-hw; Supplier 1: Digi-Key; Stock 1: 56135; Pricing 1: 1=0.73, 10=0.519, 100=0.3416, 500=0.253, 1000=0.2151 (USD); Case/Package: 0805; Weight: 0.000194oz; Case Code (Metric): 2012; Case Code (Imperial): 0805; Min Operating Temperature: -55°C; Max Operating Temperature: 85°C; Package Quantity: 1; Packaging: Tape and Reel; Capacitance: 10uF; Voltage Rating: 35V; Dielectric: X5R; Termination: SMD/SMT; Voltage Rating (DC): 35V; Length: 0.079inch; Height: 0.85mm; Width: 0.049inch; Thickness: 0.039inch; REACH SVHC: No SVHC; Lead Free: Lead Free; ComponentLink1URL: https://datasheet.ciiva.com/14894/tdkmlcccaprange-14894527.pdf; ComponentLink1Description: https://datasheet.ciiva.com/14894/tdkmlcccaprange-14894527.pdf; Supplier Part Number 1: 445-14417-1-ND
CN5 = CONECTOR PHOENIX 2 VIAS 1755736: as CN1 on sheet power-supply-hw; Supplier 1: Digi-Key; Manufacturer Part Number: 1755736; RoHS: RoHS Compliant; Category: Connectors, Interconnects; Stock 1: 11008; Pricing 1: 1=0.59, 10=0.564, 50=0.539, 100=0.5243, 250=0.49, 500=0.4508, 1000=0.4165, 2500=0.3969, 5000=0.3724 (USD); Packaging: Bulk; Part Status: Active; Type: Header, Male Pins, Shrouded (4 Side); Positions Per Level: 2; Plug Wire Entry: -; Termination Style: Solder; Mounting Type: Through Hole; Current - UL: 12A; Wire Gauge or Range - AWG: -; Wire Gauge or Range - mm²: -; Color: Green; Operating Temperature: -; Contact Mating Finish: Tin; Features: -; Ingress Protection: -; Screw Size: -; Torque - Screw: -; Wire Strip Length: -; Contact Material: -; Housing Material: Polyamide (PA), Nylon; Insulation Height: 0.472" (12.00mm); ComponentLink1URL: http://media.digikey.com/pdf/Data%20Sheets/Phoenix%20Contact%20PDFs/1755736.pdf; ComponentLink1Description: http://media.digikey.com/pdf/Data%20Sheets/Phoenix%20Contact%20PDFs/1755736.pdf; Supplier Part Number 1: 277-1150-ND
CN6 = HEADER MOLEX 22-27-2031: Manufacturer: Molex, LLC; Manufacturer Part Number: 0022272031; Pitch - Mating: 0.100" (2.54mm); Style: Board to Cable/Wire; Shrouding: Shrouded - 1 Wall; Number of Positions: 3; Number of Positions Loaded: All; Contact Length - Mating: 0.295" (7.49mm); Contact Length - Post: 0.140" (3.56mm); Overall Contact Length: 0.560" (14.22mm); Material Flammability Rating: UL94 V-0; Código LNLS: MT103887; Supplier 1: Digi-Key; RoHS: RoHS Compliant; Category: Connectors, Interconnects; Stock 1: 19040; Pricing 1: 1=0.35, 10=0.334, 25=0.2864, 50=0.2436, 100=0.234, 250=0.21012, 500=0.20056, 1000=0.16713, 2500=0.1528 (USD); Packaging: Bulk; Part Status: Active; Connector Type: Header; Contact Type: Male Pin; Number of Rows: 1; Row Spacing - Mating: -; Mounting Type: Through Hole; Termination: Solder; Fastening Type: Friction Lock; Insulation Height: 0.461" (11.70mm); Contact Shape: Square; Contact Finish - Mating: Tin; Contact Finish Thickness - Mating: 100µin (2.54µm); Contact Finish - Post: Tin; Contact Material: Brass; Insulation Material: Polyamide (PA), Nylon; Features: -; Operating Temperature: -; Ingress Protection: -; Insulation Color: Natural; Current Rating: -; Voltage Rating: -; Mated Stacking Heights: -; Contact Finish Thickness - Post: 100µin (2.54µm); Applications: Automotive, General Purpose, Medical, Telecommunications; ComponentLink1URL: http://www.molex.com/pdm_docs/sd/022272031_sd.pdf; ComponentLink1Description: http://www.molex.com/pdm_docs/sd/022272031_sd.pdf; Supplier Part Number 1: WM4112-ND
IC3 = LM324DG: as IC2 on sheet vmon-and-imon-measurements-hw; Supplier 1: Mouser; Supplier Part Number 1: 595-LM324DG4; RoHS 1: Yes; Stock 1: 4026; Pricing 1: 1=0,9, 10=0,761, 50=0,761, 100=0,583, 1000=0,407, 10000=0,381 (USD); Mount: Surface Mount; Case/Package: SOIC; Number of Pins: 14; Min Operating Temperature: 0°C; Max Operating Temperature: 70°C; Package Quantity: 50; Packaging: Rail/Tube; Max Dual Supply Voltage: 16V; Number of Circuits: 4; Bandwidth: 1.2MHz; Technology: BIPOLAR; Radiation Hardening: No; Lead Free: Lead Free; RoHS Compliant: Yes; ComponentLink1URL: https://datasheet.ciiva.com/1811/lm224-1811004.pdf?src-supplier=Digi-Key; ComponentLink1Description: https://datasheet.ciiva.com/1811/lm224-1811004.pdf?src-supplier=Digi-Key
JP1 = CONECTOR ERNI 225688: Manufacturer 1: TE Connectivity; Manufacturer Part Number 1: 225688-E; Description 1: Conn M4 Threaded Power Connector Receptacle 1 POS ST; Código LNLS: AP109660; Supplier 1: Digi-Key; Supplier Part Number 1: 2684-225688-E-ND; RoHS 1: No; Stock 1: 659; Pricing 1: 1=5,29, 10=4,802, 25=4,548, 50=4,4422, 100=4,2307, 250=3,70184, 500=3,59608, 1000=3,06725, 2500=2,85572 (USD); ComponentLink1Description: https://www.erni.com/fileadmin/import/products/assets/DC0007196.PDF; ComponentLink1URL: https://www.erni.com/fileadmin/import/products/assets/DC0007196.PDF
R1 = RESISTOR 1K: Resistor SMD 2.21K OHM 1% 1/8W 0805; Manufacturer 1: TE Connectivity; Manufacturer Part Number 1: 1-2176092-8; Description 1: SMD Chip Resistor, 1 kOhm, ± 0.1%, 250 mW, 0805 [2012 Metric], Thin Film, High Power Precision; Category 1: Chip SMD Resistors; Resistance: 1kR; Tolerance: 0.1%; Power Rating: 250mW; Temperature Coefficient: 25ppm/°C; Voltage Rating: 150V; Number of Resistors: 1; Código LNLS: MT112491; RoHS 1: Yes; Stock 1: 12918; Pricing 1: 1=0,55, 10=0,304, 50=0,304, 100=0,252, 1000=0,152, 10000=0,138 (USD); Mount: Surface Mount; Case/Package: 0805; Case Code (Metric): 2012; Case Code (Imperial): 0805; Min Operating Temperature: -55°C; Max Operating Temperature: 155°C; Packaging: Tape and Reel; Resistor Type: Thin Film; Termination: Solder; Series: RP73P, Holsworthy; Voltage Rating (DC): 150V; Number of Terminations: 2; Max Power Dissipation: 250mW; Operating Supply Voltage: 150V; Depth: 1.25mm; RoHS Compliant: Yes; Reach SVHC Compliant: 4186SVHC; Lead Free: 5697LeadFree; ComponentLink1Description: Datasheet; ComponentLink1URL: https://www.mouser.com/datasheet/2/447/YAGEO_PYu_RC_Group_51_RoHS_L_12-3313492.pdf
R3-R6 = RESISTOR 49.9R: Resistor SMD 49.9R OHM 0.1% 1/10W 0603; Manufacturer 1: Panasonic; Manufacturer Part Number 1: ERA-3AEB49R9V; Description 1: Res Thin Film 0603 49.9 Ohm 0.1% 1/10W ±25ppm/°C Molded SMD SMD Punched Carrier T/R; Category 1: Chip SMD Resistors; Power Rating: 100mW; Voltage Rating: 150V; Temperature Coefficient: 25ppm/°C; Voltage Rating (DC): 75V; Código LNLS: AP105077; Supplier 1: Mouser; Supplier Part Number 1: 667-ERA-3AEB49R9V; RoHS 1: Yes; Stock 1: 101205; Pricing 1: 1=0,35, 10=0,302, 50=0,302, 100=0,118, 1000=0,049, 10000=0,038 (USD); Mount: Surface Mount; Case/Package: 0603; Number of Pins: 2; Case Code (Metric): 1608; Case Code (Imperial): 0603; Contact Plating: Tin; Min Operating Temperature: -55°C; Max Operating Temperature: 155°C; Resistance: 49.9R; Tolerance: 0.1%; Packaging: Tape and Reel; Package Quantity: 1; Resistor Type: Thin Film; Number of Terminations: 2; Termination: SMD/SMT; Max Power Dissipation: 100mW; Features: Automotive AEC-Q200; Series: ERA-3A; Resistance Tolerance: 0.1%; Technology: METAL FILM; Length: 1.6mm; Width: 0.8mm; Height: 0.45mm; Depth: 0.8mm; Reach SVHC Compliant: No; Lead Free: Lead Free; RoHS Compliant: Yes; ComponentLink1URL: https://datasheet.ciiva.com/30262/54aoa0000ce26-30262586.pdf?src-supplier=Onlinecomponents.com; ComponentLink1Description: https://datasheet.ciiva.com/30262/54aoa0000ce26-30262586.pdf?src-supplier=Onlinecomponents.com
T1 = VOLTAGE TRANSDUCER LV 20-P: Manufacturer: LEM USA Inc.; Sensor Type: Voltage, Closed Loop; Código LNLS: AR102474; Supplier 1: Digi-Key; RoHS: RoHS Compliant; Category: Sensors, Transducers; Stock 1: 348; Pricing 1: 1=45.54, 5=43.47, 10=39.33, 25=36.2252, 50=32.085, 100=31.05 (USD); Part Status: Active; Output Type: Voltage; ComponentLink1URL: http://media.digikey.com/pdf/Data%20Sheets/LEM%20USA%20PDFs/LV%2020-P.pdf; ComponentLink1Description: http://media.digikey.com/pdf/Data%20Sheets/LEM%20USA%20PDFs/LV%2020-P.pdf; Supplier Part Number 1: 398-1020-ND; Manufacturer Part Number: LV 20-P

## Sheet voltage-and-current-display-hw.SchDoc
size A4; DrawnBy: Rogério J. Marcondeli / Samuel C. Z. Fraga
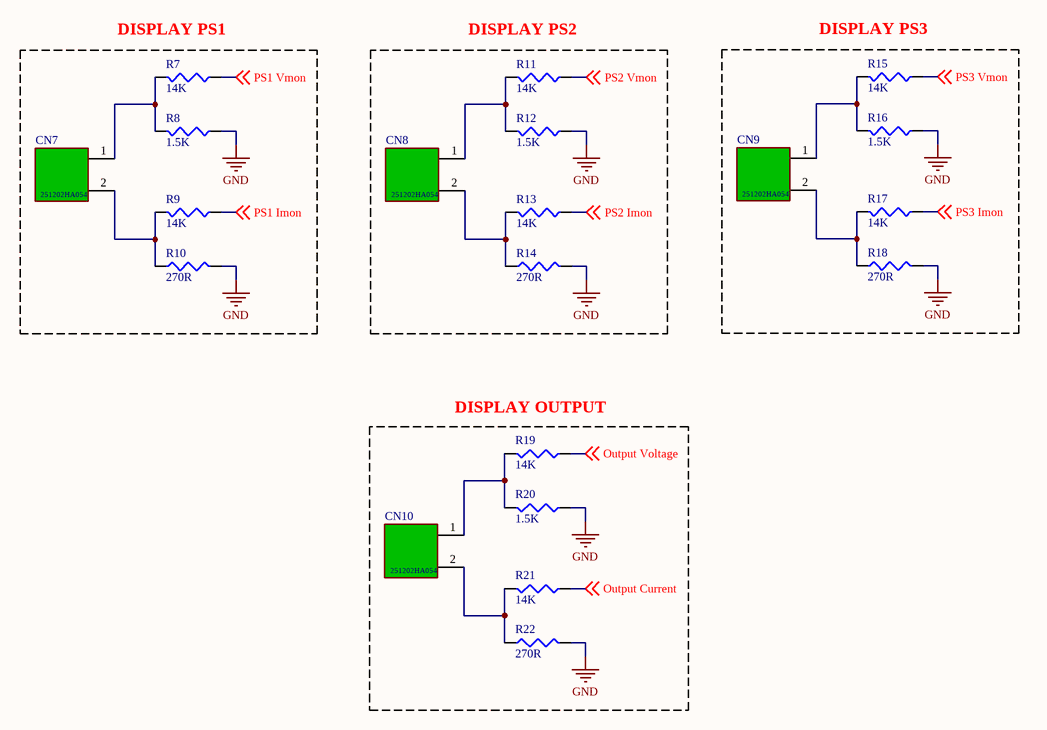
[diagram p3: voltage-and-current-display-hw.SchDoc]

### Parts
CN7  Header 2 Pin 251202HA054  [CONECTOR KK EXCON 251202HA054]  (value not drawn)
CN8  Header 2 Pin 251202HA054  [CONECTOR KK EXCON 251202HA054]  (value not drawn)
CN9  Header 2 Pin 251202HA054  [CONECTOR KK EXCON 251202HA054]  (value not drawn)
CN10  Header 2 Pin 251202HA054  [CONECTOR KK EXCON 251202HA054]  (value not drawn)
R7  14K  [R0603]
R8  1.5K  [R0603]
R9  14K  [R0603]
R10  270R  [R0603]
R11  14K  [R0603]
R12  1.5K  [R0603]
R13  14K  [R0603]
R14  270R  [R0603]
R15  14K  [R0603]
R16  1.5K  [R0603]
R17  14K  [R0603]
R18  270R  [R0603]
R19  14K  [R0603]
R20  1.5K  [R0603]
R21  14K  [R0603]
R22  270R  [R0603]

### Blocks framed on the sheet
DISPLAY PS1: CN7 R7-R10
DISPLAY PS2: CN8 R11-R14
DISPLAY PS3: CN9 R15-R18
DISPLAY OUTPUT: CN10 R19-R22

### Nets
GND: R8.1 R10.2 R12.1 R14.2 R16.1 R18.2 R20.1 R22.2
Output Current: R21.1 ; off-sheet Output Current
Output Voltage: R19.1 ; off-sheet Output Voltage
PS1 Imon: R9.1 ; off-sheet PS1 Imon
PS1 Vmon: R7.1 ; off-sheet PS1 Vmon
PS2 Imon: R13.1 ; off-sheet PS2 Imon
PS2 Vmon: R11.1 ; off-sheet PS2 Vmon
PS3 Imon: R17.1 ; off-sheet PS3 Imon
PS3 Vmon: R15.1 ; off-sheet PS3 Vmon
NetCN7_1: CN7.1 R7.2 R8.2
NetCN7_2: CN7.2 R9.2 R10.1
NetCN8_1: CN8.1 R11.2 R12.2
NetCN8_2: CN8.2 R13.2 R14.1
NetCN9_1: CN9.1 R15.2 R16.2
NetCN9_2: CN9.2 R17.2 R18.1
NetCN10_1: CN10.1 R19.2 R20.2
NetCN10_2: CN10.2 R21.2 R22.1

### Notes on the sheet
- Authors:
- Title:
- Revision:
- File:
- Project:
- Date:
- Variant:
- Sheet
- of
- DAT - INE - EMI
  Eletrônica e
  Microeletrônica
- (in symbol CONECTOR KK EXCON 251202HA054) 251202HA054

### Library data of the parts
CN7-CN10 = CONECTOR KK EXCON 251202HA054: Código LNLS: MT111636; ComponentLink1Description: https://www.excon.com.tw/images/Drawing/2512WV.pdf; ComponentLink1URL: https://www.excon.com.tw/images/Drawing/2512WV.pdf
R7 R9 R11 R13 R15 R17 R19 R21 = RESISTOR 14K: Resistor SMD 14K OHM 0.1% 1/10W 0603; Manufacturer 1: Panasonic; Manufacturer Part Number 1: ERA-3AEB1402V; Description 1: Res Thin Film 0603 14K Ohm 0.1% 1/10W ±25ppm/°C Molded SMD SMD Punched Carrier T/R; Category 1: Chip SMD Resistors; Resistance: 14kR; Temperature Coefficient: 25ppm/°C; Power Rating: 100mW; Voltage Rating: 75V; Código LNLS: AP107375; Supplier 1: Mouser; Supplier Part Number 1: 667-ERA-3AEB1402V; RoHS 1: Yes; Stock 1: 14599; Pricing 1: 1=0,31, 10=0,139, 50=0,139, 100=0,062, 1000=0,043, 10000=0,033 (USD); Mount: Surface Mount; Case/Package: 0603; Number of Pins: 2; Case Code (Metric): 1608; Case Code (Imperial): 0603; Min Operating Temperature: -55°C; Max Operating Temperature: 155°C; Tolerance: 0.1%; Resistor Type: Thin Film; Packaging: Tape and Reel; Series: ERA; Technology: METAL FILM; Resistance Tolerance: 0.1%; Length: 1.6mm; Width: 1.6mm; Height: 0.45mm; Depth: 0.8mm; ComponentLink1URL: https://datasheet.ciiva.com/11809/0900766b80eb1d8c-11809141.pdf?src-supplier=Rs; ComponentLink1Description: https://datasheet.ciiva.com/11809/0900766b80eb1d8c-11809141.pdf?src-supplier=Rs; ComponentLink2URL: https://datasheet.ciiva.com/29184/452497-da-01-en-widerstand-0603-era-29184016.pdf?src-supplier=Conrad; ComponentLink2Description: https://datasheet.ciiva.com/29184/452497-da-01-en-widerstand-0603-era-29184016.pdf?src-supplier=Conrad; ComponentLink3URL: https://datasheet.ciiva.com/9193/aoa0000ce26-9193183.pdf?src-supplier=Avnet; ComponentLink3Description: https://datasheet.ciiva.com/9193/aoa0000ce26-9193183.pdf?src-supplier=Avnet; ComponentLink4URL: https://datasheet.ciiva.com/24063/aoa0000ce26-197354-24063590.pdf?src-supplier=Mouser; ComponentLink4Description: https://datasheet.ciiva.com/24063/aoa0000ce26-197354-24063590.pdf?src-supplier=Mouser; ComponentLink5URL: https://datasheet.ciiva.com/15805/aoa0000ce26-15805493.pdf?src-supplier=Onlinecomponents.com; ComponentLink5Description: https://datasheet.ciiva.com/15805/aoa0000ce26-15805493.pdf?src-supplier=Onlinecomponents.com; ComponentLink6URL: https://datasheet.ciiva.com/5987/485442-5987128.pdf?src-supplier=Farnell; ComponentLink6Description: https://datasheet.ciiva.com/5987/485442-5987128.pdf?src-supplier=Farnell; ComponentLink7URL: https://datasheet.ciiva.com/5987/485442-5987130.pdf?src-supplier=Farnell; ComponentLink7Description: https://datasheet.ciiva.com/5987/485442-5987130.pdf?src-supplier=Farnell; ComponentLink8URL: https://datasheet.ciiva.com/5987/485442-5987131.pdf?src-supplier=Farnell; ComponentLink8Description: https://datasheet.ciiva.com/5987/485442-5987131.pdf?src-supplier=Farnell
R8 R12 R16 R20 = RESISTOR 1.5K: Resistor SMD 1.5K OHM 0.1% 1/10W 0603; Manufacturer 1: Panasonic; Manufacturer Part Number 1: ERA-3AEB152V; Description 1: Res Thin Film 0603 1.5K Ohm 0.1% 0.1W ±25ppm/°C Molded SMD Punched Carrier T/R; Category 1: Chip SMD Resistors; Resistance: 1.5kR; Temperature Coefficient: 25ppm/°C; Power Rating: 100mW; Voltage Rating: 75V; Código LNLS: MT103626; Supplier 1: Mouser; Supplier Part Number 1: 667-ERA-3AEB152V; RoHS 1: Yes; Stock 1: 5568; Pricing 1: 1=0,34, 10=0,23, 50=0,23, 100=0,094, 1000=0,05, 10000=0,036 (USD); Mount: Surface Mount; Case/Package: 0603; Number of Pins: 2; Contact Plating: Tin; Case Code (Metric): 1608; Case Code (Imperial): 0603; Size Code: 0603; Min Operating Temperature: -55°C; Max Operating Temperature: 155°C; Tolerance: 0.1%; Resistor Type: Thin Film; Packaging: Tape and Reel; Package Quantity: 1; Number of Terminations: 2; Termination: SMD/SMT; Max Power Dissipation: 100mW; Voltage Rating (DC): 75V; Features: Automotive AEC-Q200; Series: ERA-3A; Resistance Tolerance: 0.1%; Technology: METAL FILM; Length: 1.6mm; Width: 0.8mm; Height: 0.45mm; Depth: 0.8mm; Ratings: AEC-Q200; Radiation Hardening: No; Reach SVHC Compliant: No; Lead Free: Lead Free; RoHS Compliant: Yes; ComponentLink1URL: https://datasheet.ciiva.com/11811/0900766b80beefcc-11811712.pdf?src-supplier=Rs; ComponentLink1Description: https://datasheet.ciiva.com/11811/0900766b80beefcc-11811712.pdf?src-supplier=Rs; ComponentLink2URL: https://datasheet.ciiva.com/29183/450830-da-01-en-widerstand-0603-era-29183764.pdf?src-supplier=Conrad; ComponentLink2Description: https://datasheet.ciiva.com/29183/450830-da-01-en-widerstand-0603-era-29183764.pdf?src-supplier=Conrad; ComponentLink3URL: https://datasheet.ciiva.com/9117/aoa0000ce26-9117365.pdf?src-supplier=Avnet; ComponentLink3Description: https://datasheet.ciiva.com/9117/aoa0000ce26-9117365.pdf?src-supplier=Avnet; ComponentLink4URL: https://datasheet.ciiva.com/5734/485442-5734538.pdf?src-supplier=Farnell; ComponentLink4Description: https://datasheet.ciiva.com/5734/485442-5734538.pdf?src-supplier=Farnell; ComponentLink5URL: https://datasheet.ciiva.com/5734/485442-5734539.pdf?src-supplier=Farnell; ComponentLink5Description: https://datasheet.ciiva.com/5734/485442-5734539.pdf?src-supplier=Farnell; ComponentLink6URL: https://datasheet.ciiva.com/46422/485442-46422565.pdf?src-supplier=Element14; ComponentLink6Description: https://datasheet.ciiva.com/46422/485442-46422565.pdf?src-supplier=Element14; ComponentLink7URL: https://datasheet.ciiva.com/16760/70068849-16760629.pdf?src-supplier=Allied+Electronics; ComponentLink7Description: https://datasheet.ciiva.com/16760/70068849-16760629.pdf?src-supplier=Allied+Electronics; ComponentLink8URL: https://datasheet.ciiva.com/7830/485442-7830591.pdf?src-supplier=Element14; ComponentLink8Description: https://datasheet.ciiva.com/7830/485442-7830591.pdf?src-supplier=Element14; ComponentLink9URL: https://datasheet.ciiva.com/28513/485442-28513834.pdf?src-supplier=Element14; ComponentLink9Description: https://datasheet.ciiva.com/28513/485442-28513834.pdf?src-supplier=Element14; ComponentLink10URL: https://datasheet.ciiva.com/30146/54aoa0000ce26-30146117.pdf?src-supplier=Onlinecomponents.com; ComponentLink10Description: https://datasheet.ciiva.com/30146/54aoa0000ce26-30146117.pdf?src-supplier=Onlinecomponents.com; ComponentLink11URL: https://datasheet.ciiva.com/48530/era-eng-tds-48530507.pdf?src-supplier=Distrelec; ComponentLink11Description: https://datasheet.ciiva.com/48530/era-eng-tds-48530507.pdf?src-supplier=Distrelec
R10 R14 R18 R22 = RESISTOR 270R: Resistor SMD 270 OHM 1% 1/10W 0603; Manufacturer 1: Vishay Dale; Manufacturer Part Number 1: CRCW0603270RFKEAC; Description 1: Res Thick Film 0603 270 Ohm 1% 0.1W(1/10W) ±100ppm/C Pad SMD T/R; Category 1: Chip SMD Resistors; Max Power Dissipation: 100mW; Temperature Coefficient: 100ppm/°C; Código LNLS: AP100898; Supplier 1: Mouser; Supplier Part Number 1: 71-CRCW0603270RFKEAC; RoHS 1: Yes; Stock 1: 68500; Pricing 1: 1=0,1, 10=0,016, 50=0,016, 100=0,009, 1000=0,006, 10000=0,004 (USD); Case/Package: 0603; Min Operating Temperature: -55°C; Max Operating Temperature: 155°C; Packaging: Tape and Reel; Resistance: 270R; Tolerance: 1%; Number of Terminations: 2; Series: CRCW-C; RoHS Compliant: Yes; ComponentLink1URL: http://www.vishay.com/docs/28773/crcwce3.pdf?src-supplier=Digi-Key; ComponentLink1Description: http://www.vishay.com/docs/28773/crcwce3.pdf?src-supplier=Digi-Key; ComponentLink2URL: https://datasheet.octopart.com/CRCW0603270RFKEAC-Vishay-datasheet-102570912.pdf?src-supplier=Future+Electronics; ComponentLink2Description: https://datasheet.octopart.com/CRCW0603270RFKEAC-Vishay-datasheet-102570912.pdf?src-supplier=Future+Electronics